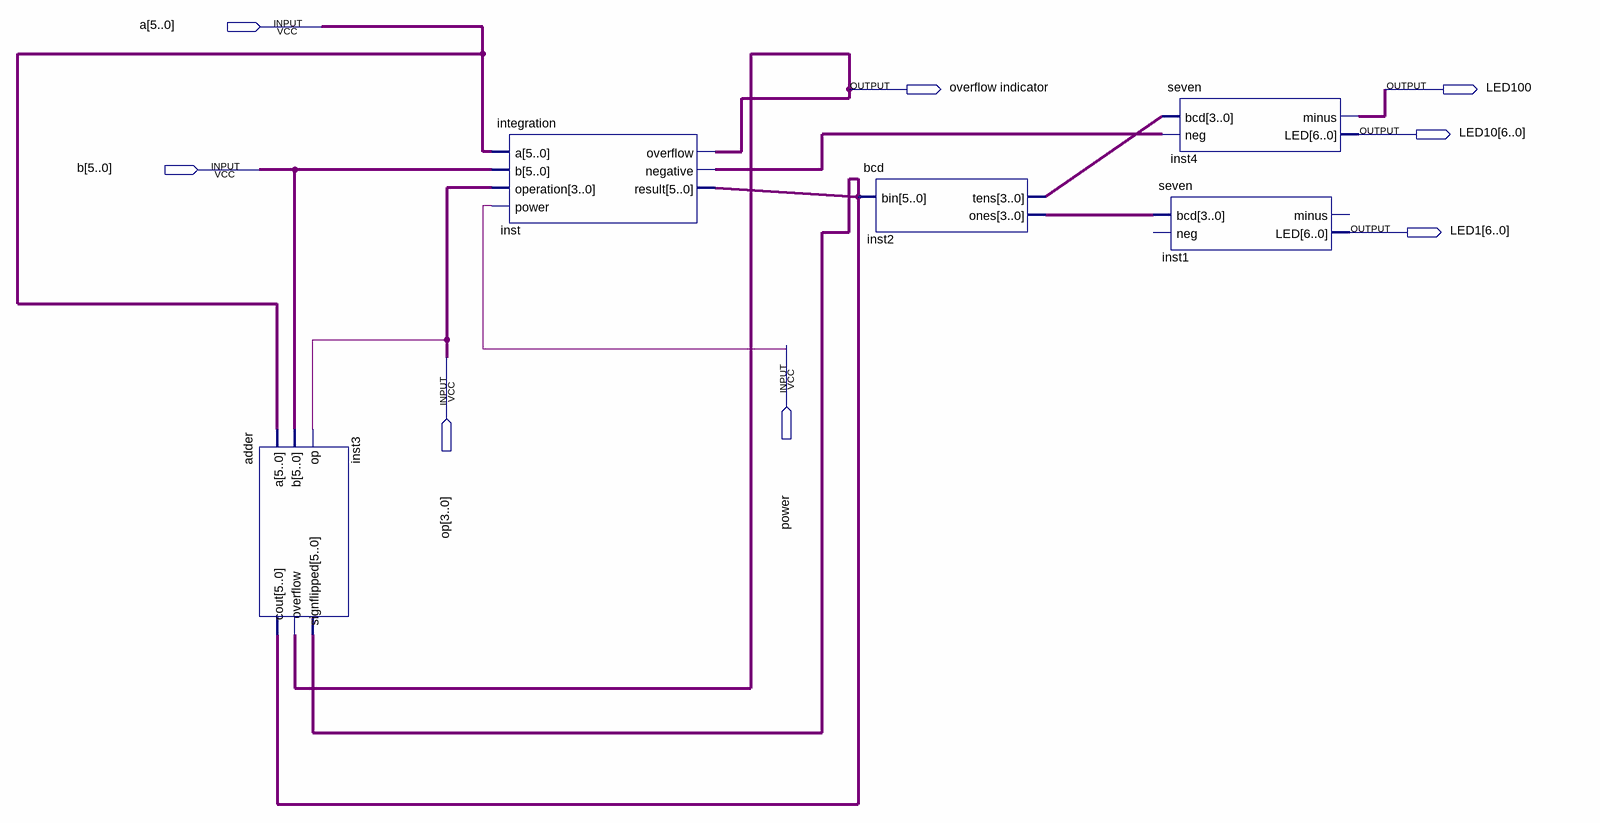
[diagram p0: schematic sheet]
// Quartus schematic all.bdf as structural Verilog: 5 symbols, 8 pins
module all (
  input  [5:0] a,
  input  [5:0] b,
  input  power,
  input  [3:0] op,
  output \overflow_indicator ,
  output LED100,
  output [6:0] LED10,
  output [6:0] LED1
);

  wire inst_negative, undriven;
  wire [3:0] inst2_ones, inst2_tens;
  wire [5:0] inst3_cout;

  adder inst3 (
    .a(a), .b(b), .op(undriven), .cout(inst3_cout), .overflow(\overflow_indicator ), .signflipped(inst3_cout));
  integration inst (
    .a(a), .b(b), .operation(op), .power(power), .overflow(\overflow_indicator ), .negative(inst_negative),
    .result(inst3_cout));
  bcd inst2 (.bin(inst3_cout), .tens(inst2_tens), .ones(inst2_ones));
  seven inst4 (.bcd(inst2_tens), .neg(inst_negative), .minus(LED10[0]), .LED(LED10));
  seven inst1 (.bcd(inst2_ones), .LED(LED1));  // open: neg, minus

  assign LED100 = LED10[0];
endmodule
